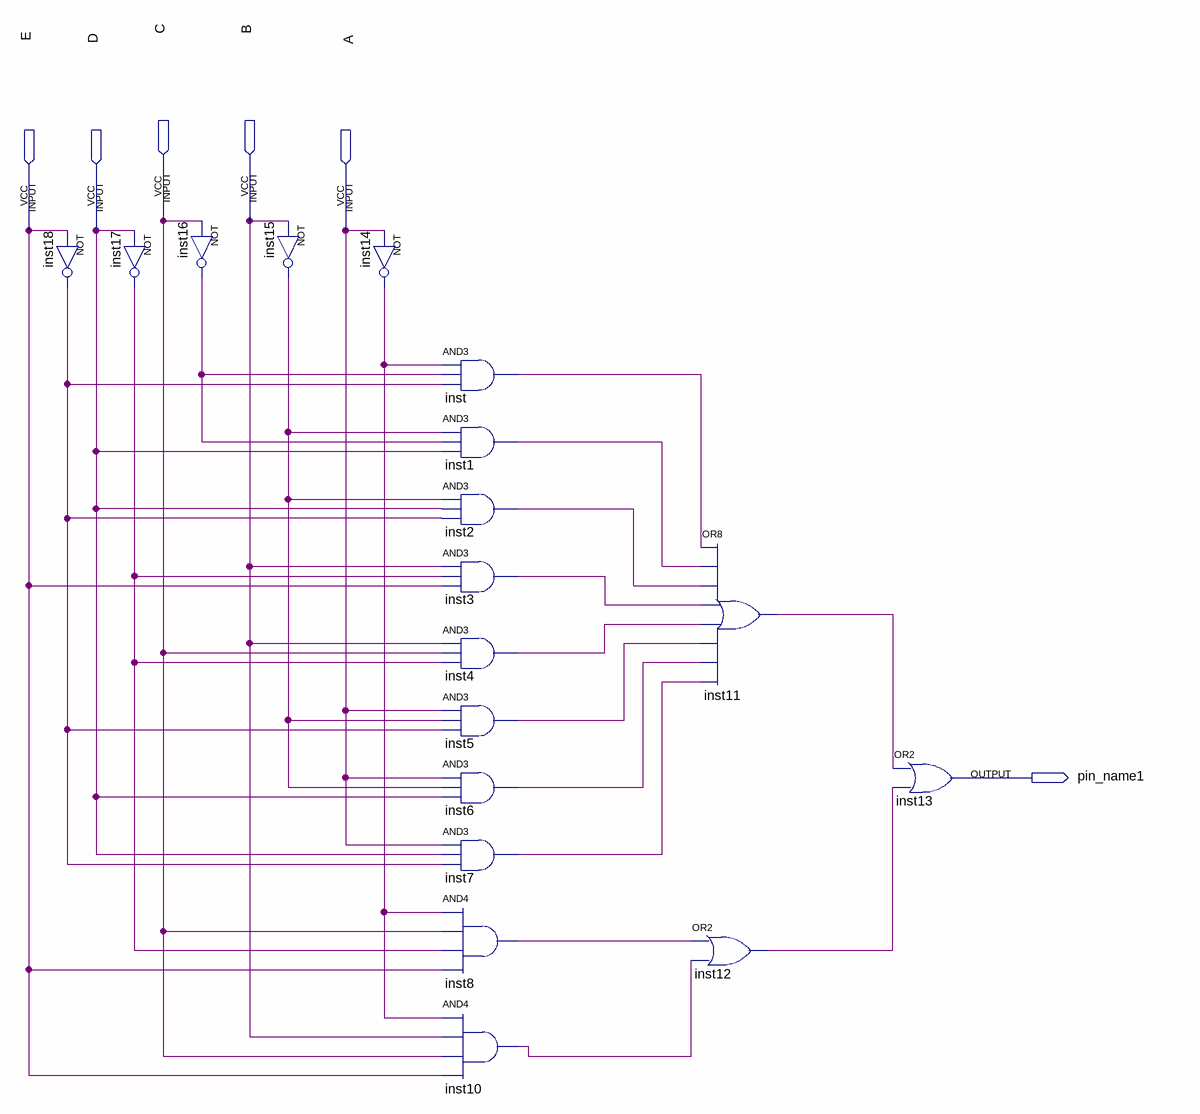
[diagram p0: schematic sheet]
// Quartus schematic decod2-4.bdf as structural Verilog: 18 symbols, 6 pins
module \decod2-4  (
  input  C,
  input  B,
  input  E,
  input  D,
  input  A,
  output pin_name1
);

  wire inst1_out, inst2_out, inst3_out, inst4_out, inst5_out, inst6_out, inst7_out, inst8_out, inst10_out,
       inst11_out, inst12_out, inst14_out, inst15_out, inst16_out, inst17_out, inst18_out, inst_out;

  not inst18 (inst18_out, E);
  not inst17 (inst17_out, D);
  not inst16 (inst16_out, C);
  not inst15 (inst15_out, B);
  not inst14 (inst14_out, A);
  and inst (inst_out, inst14_out, inst16_out, inst18_out);
  and inst1 (inst1_out, inst15_out, inst16_out, D);
  and inst2 (inst2_out, inst15_out, D, inst18_out);
  and inst3 (inst3_out, B, inst17_out, E);
  and inst4 (inst4_out, B, C, inst17_out);
  and inst5 (inst5_out, A, inst15_out, inst18_out);
  and inst6 (inst6_out, A, inst15_out, D);
  and inst7 (inst7_out, A, D, inst18_out);
  and inst8 (inst8_out, inst14_out, C, inst17_out, E);
  and inst10 (inst10_out, inst14_out, B, C, E);
  or inst11 (inst11_out, inst_out, inst1_out, inst2_out, inst3_out, inst4_out, inst5_out, inst6_out, inst7_out);
  or inst12 (inst12_out, inst8_out, inst10_out);
  or inst13 (pin_name1, inst11_out, inst12_out);
endmodule
